# Altium project AccTop.PrjPcb
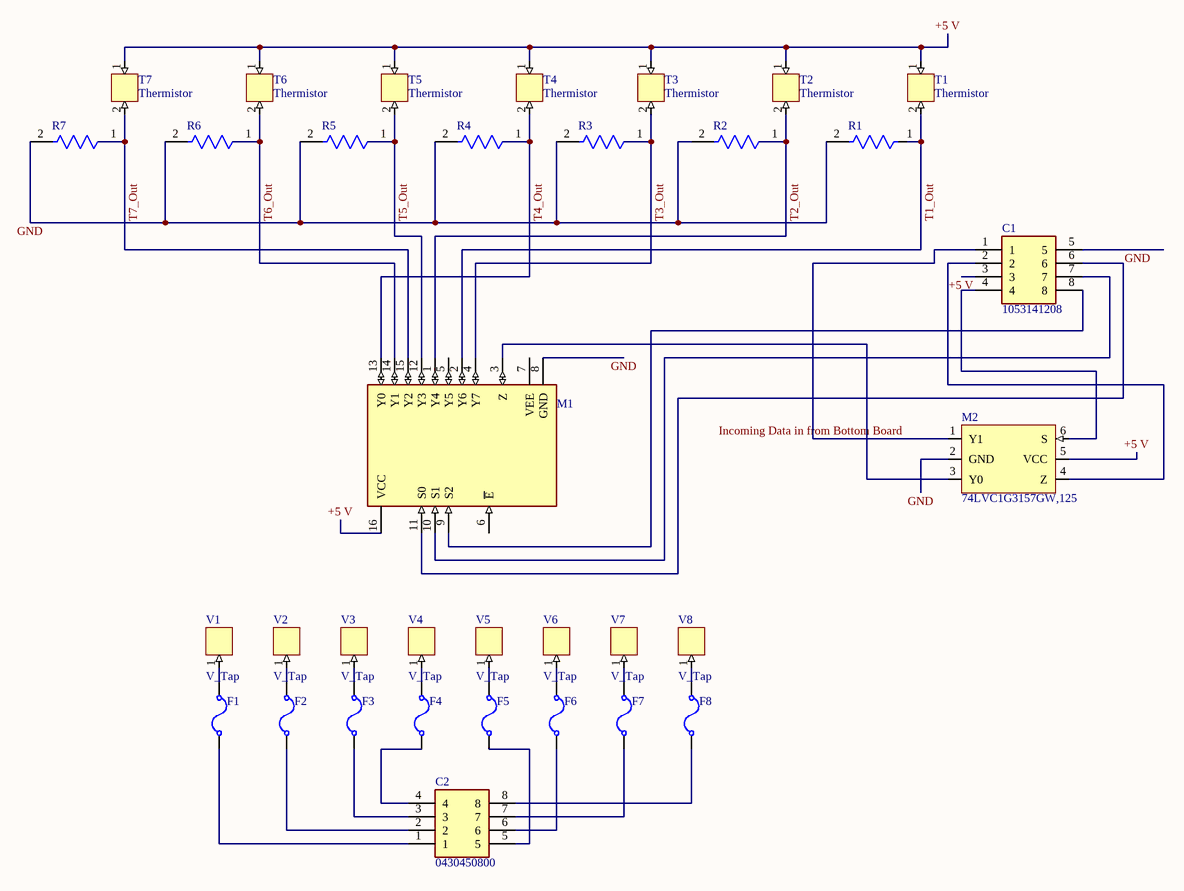
[diagram p0: AccTop.SchDoc]
1 sheet, 34 parts. Net scope: global (net labels, ports and power ports of the same name join across sheets).
Board file: AccTop.PcbDoc

## Sheet AccTop.SchDoc
size D; SheetNumber: 1; SheetTotal: 1

### Parts
C1  1053141208  [8 PIN DUAL NANO CONNECTOR]
C2  0430450800  [8 PIN DUAL CONNECTOR]
F1  0ACG-1000-TE  [Fuse]  (value not drawn)
F2  0ACG-1000-TE  [Fuse]  (value not drawn)
F3  0ACG-1000-TE  [Fuse]  (value not drawn)
F4  0ACG-1000-TE  [Fuse]  (value not drawn)
F5  0ACG-1000-TE  [Fuse]  (value not drawn)
F6  0ACG-1000-TE  [Fuse]  (value not drawn)
F7  0ACG-1000-TE  [Fuse]  (value not drawn)
F8  0ACG-1000-TE  [Fuse]  (value not drawn)
M1  74HC4051D,653  [8x1MUX]  (value not drawn)
M2  74LVC1G3157GW,125  [2x1MUX]
R1  RC0805FR-133K3L  [3.3kRes]  (value not drawn)
R2  RC0805FR-133K3L  [3.3kRes]  (value not drawn)
R3  RC0805FR-133K3L  [3.3kRes]  (value not drawn)
R4  RC0805FR-133K3L  [3.3kRes]  (value not drawn)
R5  RC0805FR-133K3L  [3.3kRes]  (value not drawn)
R6  RC0805FR-133K3L  [3.3kRes]  (value not drawn)
R7  RC0805FR-133K3L  [3.3kRes]  (value not drawn)
T1  Thermistor  [Thermistor]  (no BOM)
T2  Thermistor  [Thermistor]  (no BOM)
T3  Thermistor  [Thermistor]  (no BOM)
T4  Thermistor  [Thermistor]  (no BOM)
T5  Thermistor  [Thermistor]  (no BOM)
T6  Thermistor  [Thermistor]  (no BOM)
T7  Thermistor  [Thermistor]  (no BOM)
V1  V_Tap  [Voltage tap]  (no BOM)
V2  V_Tap  [Voltage tap]  (no BOM)
V3  V_Tap  [Voltage tap]  (no BOM)
V4  V_Tap  [Voltage tap]  (no BOM)
V5  V_Tap  [Voltage tap]  (no BOM)
V6  V_Tap  [Voltage tap]  (no BOM)
V7  V_Tap  [Voltage tap]  (no BOM)
V8  V_Tap  [Voltage tap]  (no BOM)

### Nets
+5 V: C1.3 M1.16(VCC) M2.5(VCC) T1.1 T2.1 T3.1 T4.1 T5.1 T6.1 T7.1
GND: C1.5 M1.8(GND) M2.2(GND) R1.2 R2.2 R3.2 R4.2 R5.2 R6.2 R7.2
T1_Out: M1.2(Y6) R1.1 T1.2
T2_Out: M1.1(Y4) R2.1 T2.2
T3_Out: M1.4(Y7) R3.1 T3.2
T4_Out: M1.13(Y0) R4.1 T4.2
T5_Out: M1.12(Y3) R5.1 T5.2
T6_Out: M1.14(Y1) R6.1 T6.2
T7_Out: M1.15(Y2) R7.1 T7.2
NetC1_1: C1.1 M2.1(Y1)
NetC1_2: C1.2 M2.4(Z)
NetC1_4: C1.4 M2.6(S)
NetC1_6: C1.6 M1.11(S0)
NetC1_7: C1.7 M1.10(S1)
NetC1_8: C1.8 M1.9(S2)
NetC2_1: C2.1 F1.1(PB6)
NetC2_2: C2.2 F2.1(PB6)
NetC2_3: C2.3 F3.1(PB6)
NetC2_4: C2.4 F4.1(PB6)
NetC2_5: C2.5 F5.1(PB6)
NetC2_6: C2.6 F6.1(PB6)
NetC2_7: C2.7 F7.1(PB6)
NetC2_8: C2.8 F8.1(PB6)
NetF1_2: F1.2(PB6) V1.1
NetF2_2: F2.2(PB6) V2.1
NetF3_2: F3.2(PB6) V3.1
NetF4_2: F4.2(PB6) V4.1
NetF5_2: F5.2(PB6) V5.1
NetF6_2: F6.2(PB6) V6.1
NetF7_2: F7.2(PB6) V7.1
NetF8_2: F8.2(PB6) V8.1
NetM1_3: M1.3(Z) M2.3(Y0)

Not connected (* = marked no-connect by the designer): M1 5(Y5) 6(~{E}) 7(VEE)

### Notes on the sheet
- Labels drawn without touching a wire or pin: Incoming Data in from Bottom Board

### Library data of the parts
C1 = 1053141208: Nano-Fit Right-Angle Header, Through Hole, 2.50mm Pitch, Dual Row, 8 Circuits, Glow-Wire Capable, Tray; Manufacturer_Name: Molex; Geometry.Height: 9.14mm; Manufacturer_Part_Number: 1053141208; Mouser Part Number: N/A; Mouser Price/Stock: https://www.mouser.com/Search/Refine.aspx?Keyword=N%2FA; Arrow Part Number: 1053141208; Arrow Price/Stock: https://www.arrow.com/en/products/105314-1208/molex?region=nac; Datasheet Link: https://www.molex.com/pdm_docs/sd/1053141104_sd.pdf
C2 = 0430450800: Rectangular Power Connector, 8 Contact(s), Male, Solder Terminal, Receptacle; Manufacturer: Molex; Manufacturer Part Number: 43025-0800; Color: Black; Material: Polyester; Connector Type: Power,Rectangular; Number of Positions: 8; Max Voltage Rating (AC): 600V; Contact Resistance: 10mR; Gender: Female; Max Voltage Rating (DC): 600.6kV; Current Rating: 5A; Voltage Rating: 250V; Insulation Resistance: 1GR; Pitch: 3mm; Glow Wire Compliant: Non-compliant; Approvals: UL,CSA,TUV; Row Spacing: 0.118inch; Option: General Purpose; Empty Shell: No; Mating Information: MULTIPLE MATING PARTS AVAILABLE; Board Mounting Option: PEG; Contact Style: SQ PIN-SKT; Dielectric Withstanding Voltage (AC): 1.5kV; Durability: 30Cycles; Insertion Force-Max: 11.5648N; Number Of Connectors: 1; Number Of PCB Rows: 2; Polarization Key: POLARIZED HOUSING; Withdrawl Force-Min: 3.0024N; Body Breadth: 0.345inch; Body Depth: 0.48inch; Body Length: 0.616inch; Mounting Option 1: POLARIZED LCK; Mounting Option 2: LOCKING; PCB Contact Row Spacing: 2.9972mm; Plating Thickness: 100uin; Reference Standard: UL; Reliability: COMMERCIAL; Supplier: Mouser; Supplier Part Number: 538-43025-0800; RoHS: Yes; Category: Headers and Wire Housings; Stock: 49424; Pricing: 1=0.62000, 10=0.52700, 50=0.52700, 100=0.40900, 500=0.39000, 1000=0.32200, 2500=0.29200, 5000=0.26200, 10000=0.25900, 25000=0.25300 (USD); Mounting Technology: Cable,Free Hanging; Housing Color: Black; Housing Material: Polyester; Contact Material: Bronze; Contact Plating: Tin; Min Operating Temperature: -40°C; Max Operating Temperature: 105°C; Packaging: Bulk; Termination: Crimp; Orientation: Straight; Series: 43025; Number of Rows: 2; Number of Contacts: 8; Package Quantity: 2500; Number of Circuits: 8; Number of Poles: 8; Voltage Rating (AC): 250V; Contact Gender: Female; Working Voltage: 250V; Length: 12.85mm; Width: 11.56mm; Depth: 14mm; Radiation Hardening: No; RoHS Compliant: Yes; Flammability Rating: UL94 V-0; Halogen Free: Low Halogen; Lead Free: Lead Free; Fastening Type: Ramp; Contact Type: Male Pin; Contact Finish - Mating: TIN; Shell Material: Polymer; Contact Finish - Termination: Bright Tin (Sn) - with Nickel (Ni) barrier; Insulation Color: Black; Insulation Material: Polymer; Filter Feature: No; Mixed Contacts: No; JESD-609 Code: e3; Body/Shell Style: RECEPTACLE; Contact Pattern: RECTANGULAR; Mounting Style: RIGHT ANGLE; Number of Rows Loaded: 2; PCB Contact Pattern: RECTANGULAR; Rated Current (Signal): 5A; Mating Contact Pitch: 0.118inch; Mating Contact Row Spacing: 0.118inch; Terminal Length: 0.125inch; Terminal Pitch: 2.9972mm; Reach SVHC Compliant: Yes; DIN Conformance: No; IEC Conformance: No; MIL Conformance: No; ComponentLink1URL: https://datasheet.ciiva.com:443/pdfs/VipMasterIC/IC/MOLE/MOLE-S-A0003536766/MOLE-S-A0003536766-1.pdf?src-supplier=IHS+Markit; ComponentLink1Description: https://datasheet.ciiva.com:443/pdfs/VipMasterIC/IC/MOLE/MOLE-S-A0003536766/MOLE-S-A0003536766-1.pdf?src-supplier=IHS+Markit; ComponentLink2URL: https://datasheet.ciiva.com/19462/883536-19462164.pdf?src-supplier=Jameco; ComponentLink2Description: https://datasheet.ciiva.com/19462/883536-19462164.pdf?src-supplier=Jameco; ComponentLink3URL: https://datasheet.ciiva.com/7683/27645-7683683.pdf?src-supplier=Element14; ComponentLink3Description: https://datasheet.ciiva.com/7683/27645-7683683.pdf?src-supplier=Element14; ComponentLink4URL: https://datasheet.ciiva.com/30198/267770430450800-pcb-headers-30198875.pdf?src-supplier=Onlinecomponents.com; ComponentLink4Description: https://datasheet.ciiva.com/30198/267770430450800-pcb-headers-30198875.pdf?src-supplier=Onlinecomponents.com; ComponentLink5URL: https://datasheet.ciiva.com/5158/0430450800-pcb-headers-142625-5158817.pdf?src-supplier=Mouser; ComponentLink5Description: https://datasheet.ciiva.com/5158/0430450800-pcb-headers-142625-5158817.pdf?src-supplier=Mouser; ComponentLink6URL: https://datasheet.ciiva.com/11751/0900766b80027348-11751142.pdf?src-supplier=Rs; ComponentLink6Description: https://datasheet.ciiva.com/11751/0900766b80027348-11751142.pdf?src-supplier=Rs; ComponentLink7URL: https://datasheet.ciiva.com/10087/0430450800-pcb-headers-10087853.pdf?src-supplier=Avnet; ComponentLink7Description: https://datasheet.ciiva.com/10087/0430450800-pcb-headers-10087853.pdf?src-supplier=Avnet; ComponentLink8URL: https://datasheet.ciiva.com/14155/04402310-14155206.pdf?src-supplier=Distrelec; ComponentLink8Description: https://datasheet.ciiva.com/14155/04402310-14155206.pdf?src-supplier=Distrelec; ComponentLink9URL: https://datasheet.ciiva.com/1443/1850016-1443537.pdf?src-supplier=Element14; ComponentLink9Description: https://datasheet.ciiva.com/1443/1850016-1443537.pdf?src-supplier=Element14
F1-F8 = 0ACG-1000-TE: Electric Fuse, 1A, 350VAC, 500VDC, 100A (IR), Surface Mount; Manufacturer: Bel; Supplier: Newark; Supplier Part Number: 71AJ7068; Manufacturer Part Number: 0ACG-1000-TE; RoHS: Yes; Category: Fuses; Stock: 965; Pricing: 1=3.46000, 10=3.34000, 25=2.98000, 50=2.62000, 100=2.14000, 250=2.08000 (USD)
M1 = 74HC4051D: IC MUX/DEMUX 8X1 16SOIC
M2 = 74LVC1G3157GW,125: Single-Ended Multiplexer, 1 Func, 2 Channel, CMOS, PDSO6; Manufacturer: Nexperia; Package Body Material: Plastic; Channels: 1; Time @ Peak Reflow Temperature-Max (s): 30s; Number of Channels: 2; Off-state Isolation-Nom: 42dB; On-state Resistance-Max (Ron): 38R; Max Supply Voltage: 5.5V; Min Supply Voltage: 1.65V; Nominal Supply Voltage: 2.7V; Switch-off Time-Max: 5ns; Switch-on Time-Max: 6ns; Qualification Status: Not Qualified; Supplier: Future Electronics; Supplier Part Number: 9326695; Manufacturer Part Number: 74LVC1G3157GW,125; RoHS: Yes; Category: Decoders and Multiplexers; Stock: 114000; Pricing: 3000=0.09980, 9000=0.09590, 12000=0.09490, 30000=0.09180, 45000=0.08880 (USD); RoHS Compliant: Yes; ComponentLink1URL: http://www.farnell.com/datasheets/2053574.pdf?src-supplier=Farnell; ComponentLink1Description: http://www.farnell.com/datasheets/2053574.pdf?src-supplier=Farnell; ComponentLink2URL: https://assets.nexperia.com/documents/data-sheet/74LVC1G3157.pdf?src-supplier=Digi-Key; ComponentLink2Description: https://assets.nexperia.com/documents/data-sheet/74LVC1G3157.pdf?src-supplier=Digi-Key; Case/Package: TSSOP; Pins: 6; Terminal Finish: Tin; Package Shape: Rectangular; Min Operating Temperature: -40°C; Max Operating Temperature: 125°C; JESD-609 Code: e3; JESD-30 Code: R-PDSO-G6; Moisture Sensitivity Level: 1; Package Style: SMALL OUTLINE, THIN PROFILE, SHRINK PITCHMeter; Peak Reflow Temperature (Cel): 260°C; Surface Mount: Yes; Technology: CMOS; Terminal Form: Gull Wing; Terminal Position: DUAL; Throw Configuration: SINGLE-ENDED MULTIPLEXER; Length: 2mm; Width: 1.25mm; Height - Seated (Max): 1.1mm; Terminal Pitch: 0.65mm; Reach SVHC Compliant: Yes; Temperature Grade: AUTOMOTIVE; ComponentLink3URL: https://datasheet.ciiva.com:443/pdfs/VipMasterIC/IC/PHGL/PHGLS25912/PHGLS25912-1.pdf?src-supplier=IHS+Markit; ComponentLink3Description: https://datasheet.ciiva.com:443/pdfs/VipMasterIC/IC/PHGL/PHGLS25912/PHGLS25912-1.pdf?src-supplier=IHS+Markit
R1-R7 = RC0805FR-133K3L: Fixed Resistor, Metal Glaze/thick Film, 0.125W, 3300ohm, 150V, 1% +/-Tol, 100ppm/Cel, Surface Mount, 0805; Manufacturer: KOA Speer; Manufacturer Part Number: RK73G2ATTD3301F; Resistance: 3.3kR; Power Rating: 125mW; Temperature Coefficient: 50ppm/°C; Additional Feature: HIGH PRECISION; Rated Temperature: 70°C; Value: 3.3kR; Package Height: 0.5mm; Package Length: 2mm; Package Width: 1.25mm; Reference Standard: AEC-Q200; Construction: Rectangular; Length: 2mm; Termination: SMD/SMT; Military Standard: Not; Series: RK73G; Case/Package: 0805; Depth: 1.25mm; Voltage Rating: 150V; Packaging: Tape and Reel; Case Code (Imperial): 0805; Max Operating Temperature: 125°C; Tolerance: 1%; Case Code (Metric): 2012; Resistor Type: Thick Film; Min Operating Temperature: -55°C; RoHS Compliant: Yes; Supplier: Arrow Electronics; Supplier Part Number: RK73G2ATTD3301F; RoHS: Yes; Category: Chip SMD Resistors; Stock: 4469; Pricing: 1=0.2602, 10=0.219, 25=0.2168, 100=0.0859, 250=0.0829, 500=0.0771, 1000=0.0463, 3000=0.0331 (USD); Mounting Technology: Surface Mount; Pins: 2; Terminal Finish: Nickel; JESD-609 Code: e3; Package Style: SMTMeter; Power: 125mW; Technology: THICK FILM/METAL GLAZE; Working Voltage: 150V; Reach SVHC Compliant: Yes; ComponentLink1URL: https://datasheet.ciiva.com:443/pdfs/VipMasterIC/IC/KOAS/KOAS-S-A0009827357/KOAS-S-A0009827357-1.pdf?src-supplier=IHS+Markit; ComponentLink1Description: https://datasheet.ciiva.com:443/pdfs/VipMasterIC/IC/KOAS/KOAS-S-A0009827357/KOAS-S-A0009827357-1.pdf?src-supplier=IHS+Markit; ComponentLink2URL: https://datasheet.ciiva.com/5554/rk73g-5554844.pdf?src-supplier=Mouser; ComponentLink2Description: https://datasheet.ciiva.com/5554/rk73g-5554844.pdf?src-supplier=Mouser; Package Shape: Rectangular; ComponentLink3URL: https://datasheet.ciiva.com:443/pdfs/VipMasterIC/IC/YAGO/YAGO-S-A0008145938/YAGO-S-A0008145938-1.pdf?src-supplier=IHS+Markit; ComponentLink3Description: https://datasheet.ciiva.com:443/pdfs/VipMasterIC/IC/YAGO/YAGO-S-A0008145938/YAGO-S-A0008145938-1.pdf?src-supplier=IHS+Markit; ComponentLink4URL: http://www.mouser.com/ds/2/447/Yageo_08112016_RC0805-968729.pdf?src-supplier=Mouser; ComponentLink4Description: http://www.mouser.com/ds/2/447/Yageo_08112016_RC0805-968729.pdf?src-supplier=Mouser; ComponentLink5URL: http://www.yageo.com/pdf/PYu-RC0805_51_RoHS_L_4.pdf?src-supplier=Avnet; ComponentLink5Description: http://www.yageo.com/pdf/PYu-RC0805_51_RoHS_L_4.pdf?src-supplier=Avnet; Supplier 1: Future Electronics; Supplier Part Number 1: 3067720